# EAGLE design Mayfly_v0p5_outline (EAGLE 7.5.0)
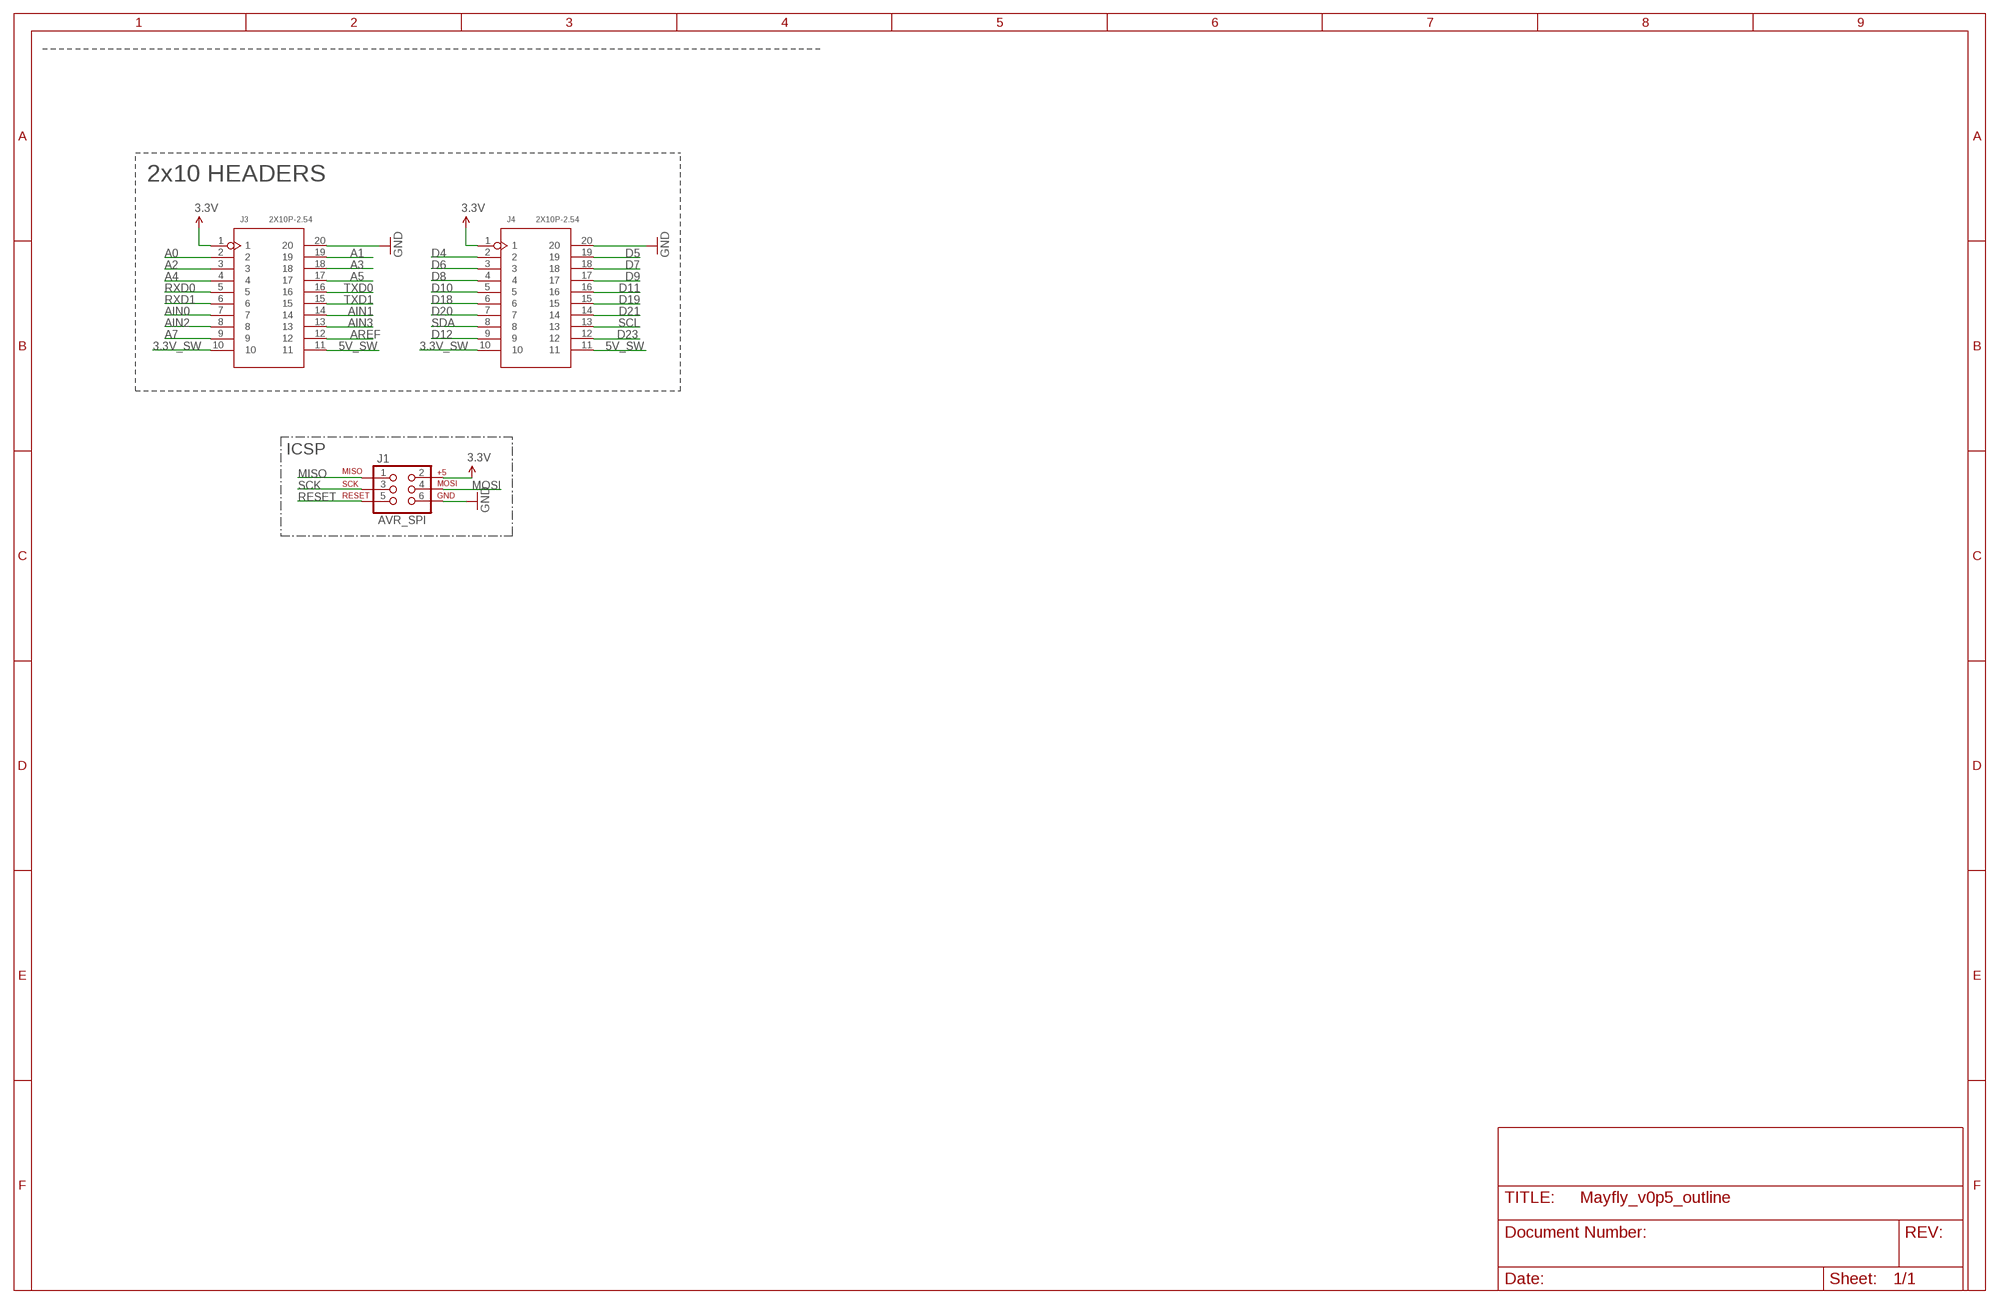
[diagram p0: schematic, sheet 1]

## Parts
J1  AVR_SPI  AVR_SPI_PRG_6NS  [2X3-NS]
J3  2X10P-2.54  DIP-BLACK-FEMALE-HEADER(2X10P-2.54)-2.54  [H2X10-2.54]
J4  2X10P-2.54  DIP-BLACK-FEMALE-HEADER(2X10P-2.54)-2.54  [H2X10-2.54]

## Nets
3.3V: J1.2 J3.1 J4.1
3.3V_SW: J3.10 J4.10
5V_SW: J3.11 J4.11
A0: J3.2
A1: J3.19
A2: J3.3
A3: J3.18
A4: J3.4
A5: J3.17
A7: J3.9
AIN0: J3.7
AIN1: J3.14
AIN2: J3.8
AIN3: J3.13
AREF: J3.12
D4: J4.2
D5: J4.19
D6: J4.3
D7: J4.18
D8: J4.4
D9: J4.17
D10: J4.5
D11: J4.16
D12: J4.9
D18: J4.6
D19: J4.15
D20: J4.7
D21: J4.14
D23: J4.12
GND: J1.6 J3.20 J4.20
MISO: J1.1
MOSI: J1.4
RESET: J1.5
RXD0: J3.5
RXD1: J3.6
SCK: J1.3
SCL: J4.13
SDA: J4.8
TXD0: J3.16
TXD1: J3.15

## Notes on the sheet
- 2x10 HEADERS
- ICSP

## Library data of the parts
J1 = SparkFun-Connectors:AVR_SPI_PRG_6: AVR ISP 6 Pin This is the reduced ISP connector for AVR programming. Common on Arduino. This footprint will take up less PCB space and can be used with a 10-pin to 6-pin adapter such as SKU: BOB-08508
J3 J4 = Seeed-OPL-Connector:DIP-BLACK-FEMALE-HEADER(2X10P-2.54): 320030090; MPN: F185-1210A0BA1

## Board
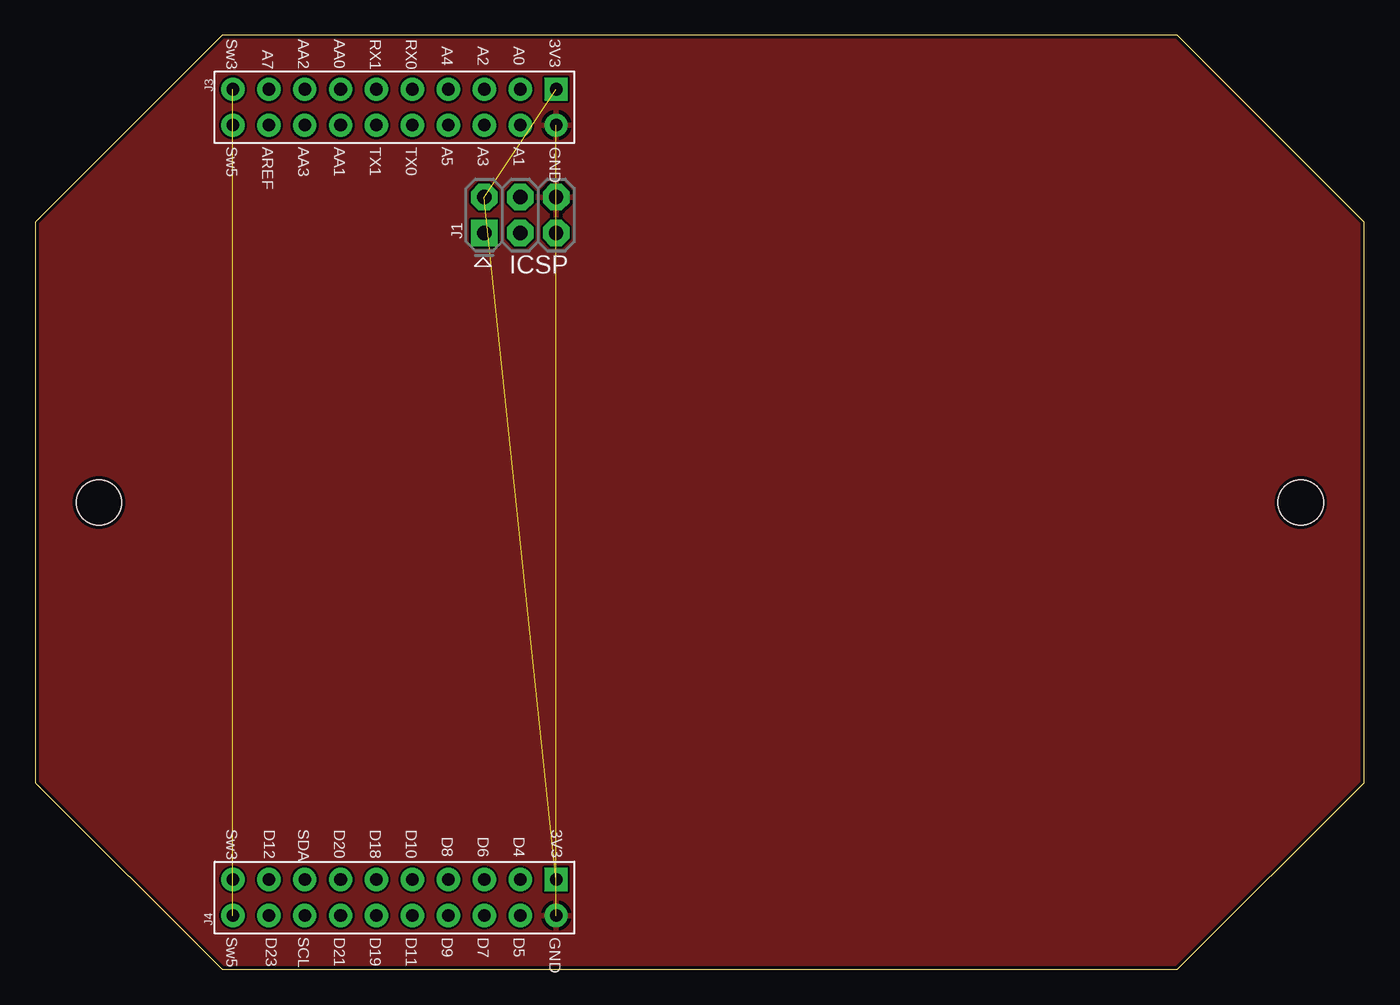
[diagram p1: board, top side]
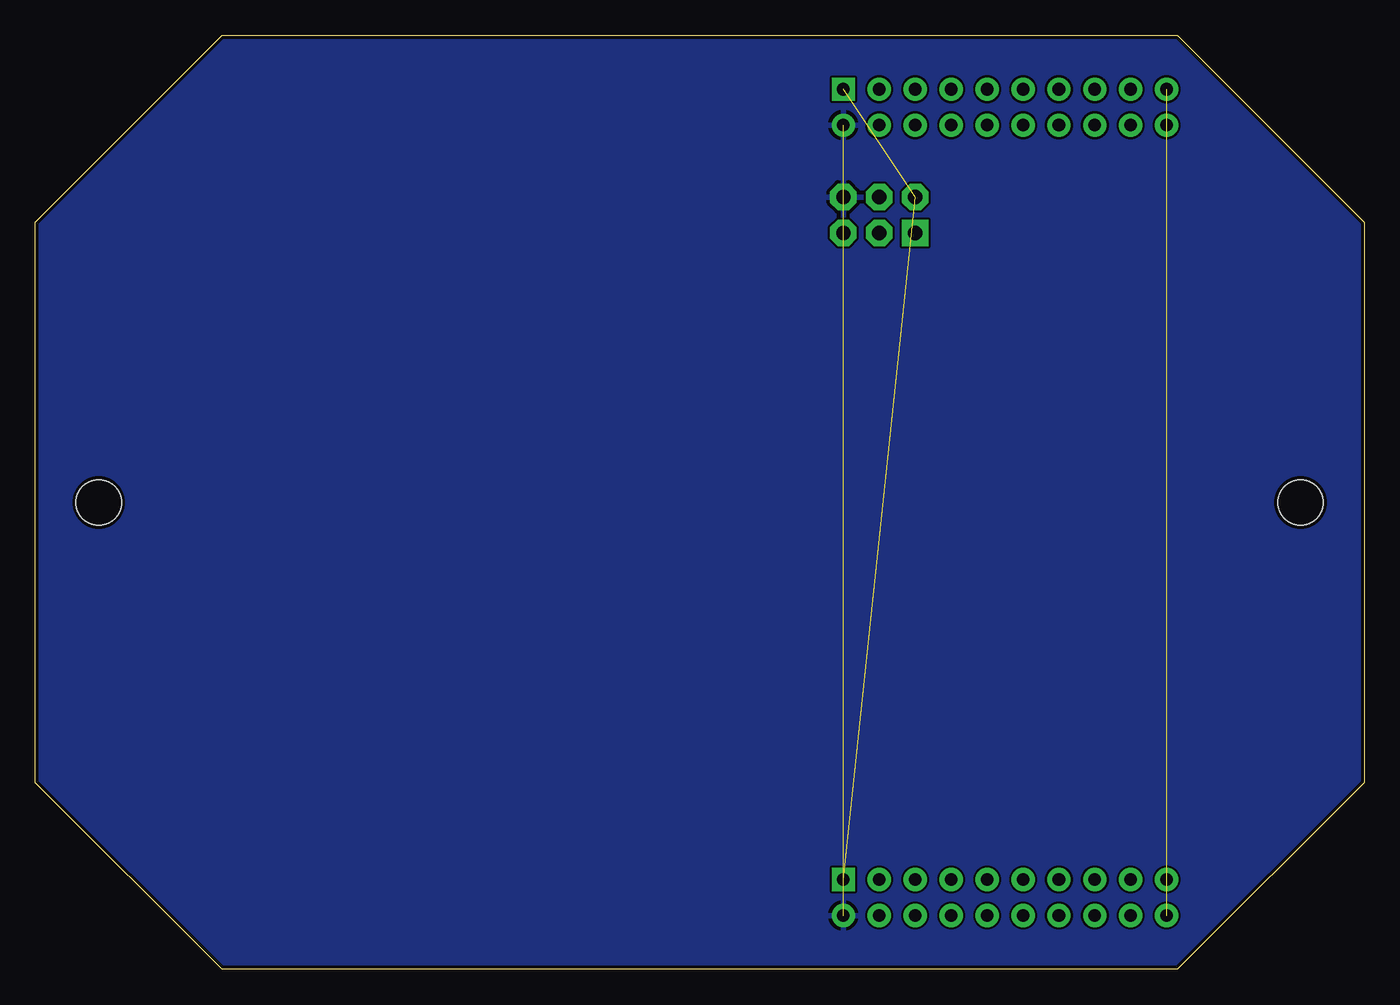
[diagram p2: board, bottom side, seen from below]

Size 93.98 x 66.04 mm. Coordinates in mm from the lower left corner, seen from the top.
Outline: 0,52.83 0,13.21 13.21,0 80.77,0 93.98,13.21 93.98,52.83 80.77,66.04 13.21,66.04 0,52.83
Copper layers (1*2*15*16): Top 0.035mm / dielectric 0.2mm / Route2 0.0175mm / dielectric 1.1mm / Route15 0.0175mm / dielectric 0.2mm / Bottom 0.035mm
Design rules "DEEGOU-DRU": minimum track width 6mil, minimum drill 12mil, track to track 6mil, track to pad 6mil, pad to pad 6mil, via to via 6mil, smd to smd 0mil, copper to edge 10mil, drill to drill 10mil, minimum pad ring 6mil, minimum via ring 6mil, stop-mask expansion 2mil, vias tented up to drill 25mil, thermal gap 10mil
Holes 3.2 mm at 89.5,33.02 4.5,33.02

### Footprints (pad centres in the part's own frame; a part is rotated, then mirrored left to right if it is on the bottom)
2X3-NS = drill 1.016 pad 1.88 square: 1 -2.54,-1.27 | drill 1.016 pad 1.88 octagon: 2 -2.54,1.27; 3 0,-1.27; 4 0,1.27; 5 2.54,-1.27; 6 2.54,1.27
H2X10-2.54 = drill 0.889 pad 1.651 square: 1 -1.27,11.43 | drill 0.889 pad 1.651: 2 -1.27,8.89; 3 -1.27,6.35; 4 -1.27,3.81; 5 -1.27,1.27; 6 -1.27,-1.27; 7 -1.27,-3.81; 8 -1.27,-6.35; 9 -1.27,-8.89; 10 -1.27,-11.43; 11 1.27,-11.43; 12 1.27,-8.89; 13 1.27,-6.35; 14 1.27,-3.81; 15 1.27,-1.27; 16 1.27,1.27; 17 1.27,3.81; 18 1.27,6.35; 19 1.27,8.89; 20 1.27,11.43

### Placement (x,y rotation side)
J1  34.29,53.34 0 top
J3  25.4,60.96 270 top
J4  25.4,5.08 270 top

### Tracks (layer width: path | path; a pad name or v marks a point on that pad's centre or on a via)
3.3V  (2 unrouted)
3.3V_SW  (1 unrouted)
5V_SW  (1 unrouted)
GND  (2 unrouted)
  pour Bottom: -0.7,67.54 94.8,67.04 95.1,-0.7 -0.6,-0.6
  pour Top: -1.3,68.04 95.5,67.74 95.6,-1.2 -1.1,-1.2

### Text on the board
tPlace: ICSP
tNames: Sw3 | AA2 | AA0 | RX1 | RX0 | 3V3 | A7 | A4 | A2 | A0 | Sw5 | AREF | AA3 | AA1 | TX1 | TX0 | A5 | A3 | A1 | GND | Sw3 | D12 | SDA | D20 | D18 | D10 | 3V3 | D8 | D6 | D4 | Sw5 | D23 | SCL | D21 | D19 | D11 | D9 | D7 | D5 | GND